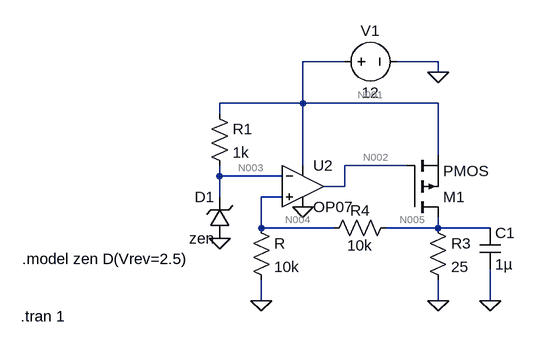
[diagram p0: schematic LDO regulator.asc]
LDO regulator.asc, the LTspice schematic file:
Version 4
SHEET 1 880 680
WIRE 256 -32 192 -32
WIRE 400 -32 336 -32
WIRE 400 -16 400 -32
WIRE 192 32 192 -32
WIRE 192 32 64 32
WIRE 400 32 192 32
WIRE 64 48 64 32
WIRE 400 112 400 32
WIRE 192 128 192 32
WIRE 352 128 256 128
WIRE 64 144 64 128
WIRE 160 144 64 144
WIRE 256 160 256 128
WIRE 256 160 224 160
WIRE 64 176 64 144
WIRE 160 176 128 176
WIRE 128 224 128 176
WIRE 240 224 128 224
WIRE 400 224 400 208
WIRE 400 224 320 224
WIRE 480 224 400 224
WIRE 128 336 128 304
WIRE 400 336 400 304
WIRE 480 336 480 288
FLAG 192 192 0
FLAG 128 336 0
FLAG 400 336 0
FLAG 400 -16 0
FLAG 480 336 0
FLAG 64 240 0
SYMBOL zener 80 240 R180
WINDOW 0 24 64 Left 2
WINDOW 3 24 0 Left 2
SYMATTR InstName D1
SYMATTR Value zen
SYMBOL res 48 32 R0
SYMATTR InstName R1
SYMATTR Value 1k
SYMBOL res 112 208 R0
SYMATTR InstName R
SYMATTR Value 10k
SYMBOL res 384 208 R0
SYMATTR InstName R3
SYMATTR Value 25
SYMBOL res 336 208 R90
WINDOW 0 5 56 VBottom 2
WINDOW 3 27 56 VTop 2
SYMATTR InstName R4
SYMATTR Value 10k
SYMBOL voltage 240 -32 M90
WINDOW 0 -32 56 VBottom 2
WINDOW 3 32 56 VTop 2
WINDOW 123 0 0 Left 0
WINDOW 39 -4 56 VBottom 2
SYMATTR InstName V1
SYMATTR Value 12
SYMBOL pmos 352 208 M180
SYMATTR InstName M1
SYMBOL cap 464 224 R0
SYMATTR InstName C1
SYMATTR Value 1µ
SYMBOL OpAmps\\OP07 192 96 R0
SYMATTR InstName U2
TEXT -240 272 Left 2 !.model zen D(Vrev=2.5)
TEXT -242 360 Left 2 !.tran 1

The netlist it stands for:
* LDO regulator.asc
D1 0 N003 zen
R1 N001 N003 1k
R N004 0 10k
R3 N005 0 25
R4 N005 N004 10k
V1 N001 0 12
M1 N005 N002 N001 N001 PMOS
C1 N005 0 1µ
XU2 N004 N003 N001 0 N002 LT1001  ; OP07, pins In+ In- V+ V- OUT
.model D D
.lib standard.dio
.model NMOS NMOS
.model PMOS PMOS
.lib standard.mos
.model zen D(Vrev=2.5)
.tran 1
.lib LTC.lib
.backanno
.end

* Results of the author's LTspice run, read from the files saved beside the schematic
* Operating Point, zero values left out:
*   V(n003) = 2.5 V
*   V(n001) = 12 V
*   V(n004) = 872.5 mV
*   V(n005) = 32.74 mV
*   V(n002) = 929.5 mV
*   Id(M1) = -1.226 mA
*   Ib(M1) = 11.98 pA
*   Is(M1) = 1.226 mA
*   I(D1) = -9.329 mA
*   I(R4) = -83.98 µA
*   I(R3) = 1.31 mA
*   I(R) = 87.25 µA
*   I(R1) = 9.5 mA
*   I(V1) = -12.98 mA
*   Ix(u2:1) = -171.2 µA
*   Ix(u2:2) = 171.2 µA
*   Ix(u2:3) = 2.254 mA
*   Ix(u2:4) = -2.247 mA
*   Ix(u2:5) = 10.14 pA